# EAGLE schematic plate (EAGLE 9.5.0)
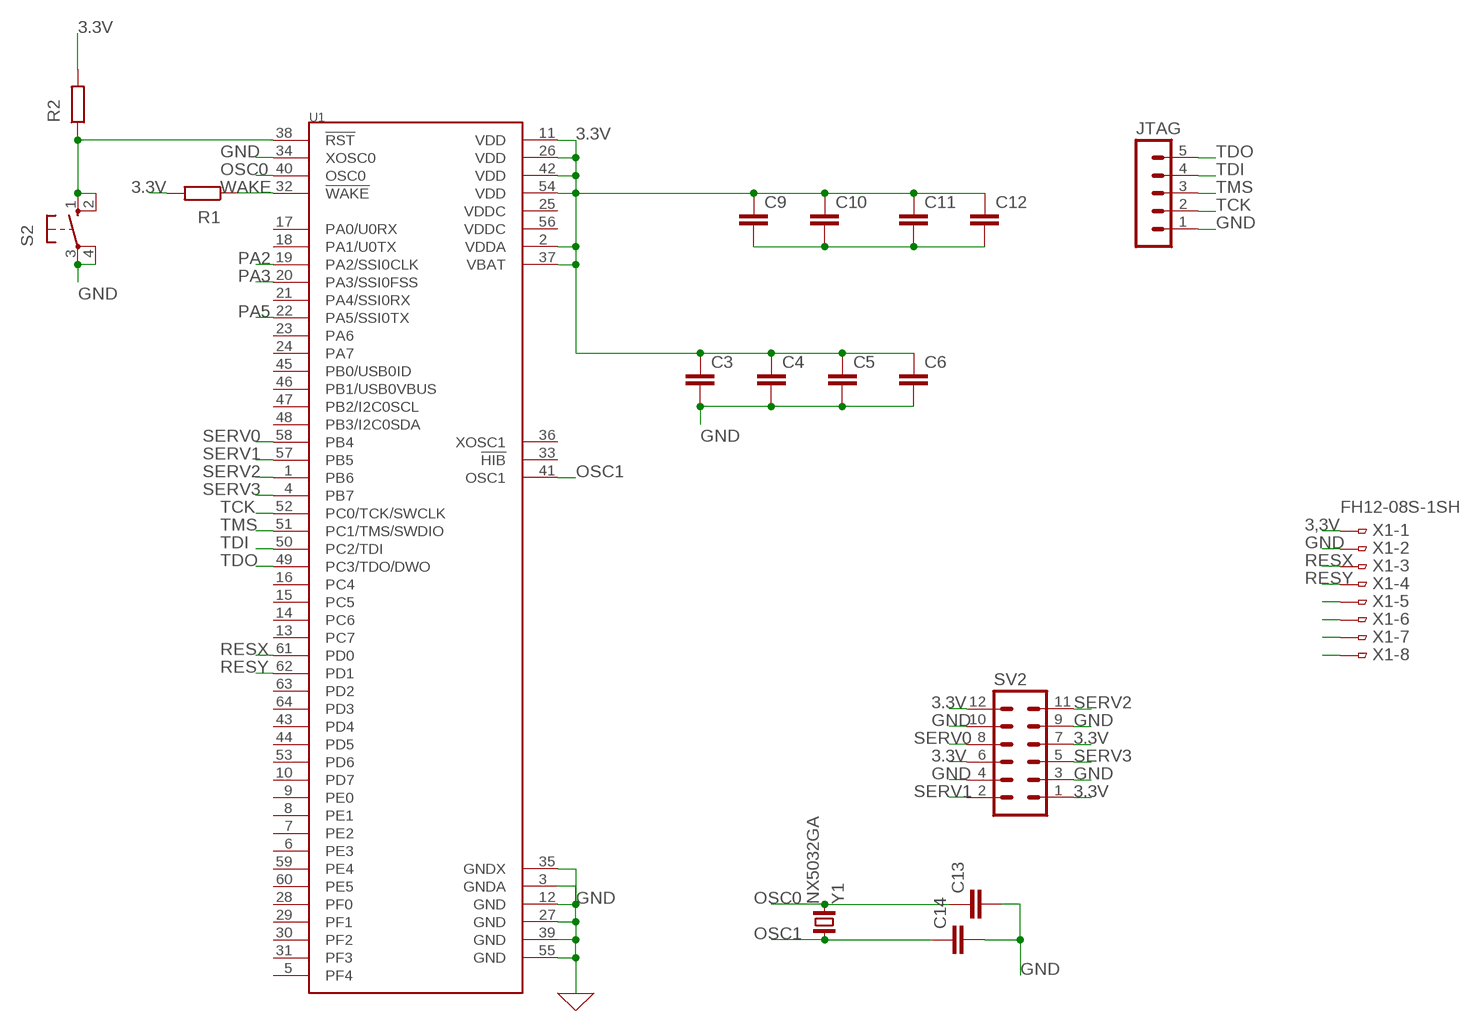
[diagram p0: schematic, sheet 1]

## Parts
C3  C2.5/2  [C2.5-2]
C4  C2.5/2  [C2.5-2]
C5  C2.5/2  [C2.5-2]
C6  C2.5/2  [C2.5-2]
C9  C2.5/2  [C2.5-2]
C10  C2.5/2  [C2.5-2]
C11  C2.5/2  [C2.5-2]
C12  C2.5/2  [C2.5-2]
C13  C2.5/2  [C2.5-2]
C14  C2.5/2  [C2.5-2]
JTAG  MA05-1  [MA05-1]
R1  R  (no package)
R2  R  (no package)
S2  10-XX  [B3F-10XX]
SV2  MA06-2  [MA06-2]
U1  TM4C123GH6PMI  [QFP50P1200X1200X160-64N]
X1  FH12-08S-1SH  [FH12-08S-1SH]
Y1  NX5032GA  [2-SMD-5X3]

## Nets
3,3V: X1.1
3.3V: C3.1 C4.1 C5.1 C6.1 C9.1 C10.1 C11.1 C12.1 R1.2 R2.2 SV2.1 SV2.6 SV2.7 SV2.12 U1.2(VDDA) U1.11(VDD) U1.26(VDD) U1.37(VBAT) U1.42(VDD) U1.54(VDD)
GND: C3.2 C4.2 C5.2 C6.2 C13.2 C14.2 JTAG.1 S2.3(P) S2.4(P1) SV2.3 SV2.4 SV2.9 SV2.10 U1.3(GNDA) U1.12(GND) U1.27(GND) U1.34(XOSC0) U1.35(GNDX) U1.39(GND) U1.55(GND) X1.2
N$1: C9.2 C10.2 C11.2 C12.2
N$6: R2.1 S2.1(S) S2.2(S1) U1.38(!RST)
N$13: X1.5
N$14: X1.6
N$15: X1.7
N$16: X1.8
OSC0: C13.1 U1.40(OSC0) Y1.2
OSC1: C14.1 U1.41(OSC1) Y1.1
PA2: U1.19(PA2/SSI0CLK)
PA3: U1.20(PA3/SSI0FSS)
PA5: U1.22(PA5/SSI0TX)
RESX: U1.61(PD0) X1.3
RESY: U1.62(PD1) X1.4
SERV0: SV2.8 U1.58(PB4)
SERV1: SV2.2 U1.57(PB5)
SERV2: SV2.11 U1.1(PB6)
SERV3: SV2.5 U1.4(PB7)
TCK: JTAG.2 U1.52(PC0/TCK/SWCLK)
TDI: JTAG.4 U1.50(PC2/TDI)
TDO: JTAG.5 U1.49(PC3/TDO/DWO)
TMS: JTAG.3 U1.51(PC1/TMS/SWDIO)
WAKE: R1.1 U1.32(!WAKE)
Unconnected: U1.5(PF4) U1.6(PE3) U1.7(PE2) U1.8(PE1) U1.9(PE0) U1.10(PD7) U1.13(PC7) U1.14(PC6) U1.15(PC5) U1.16(PC4) U1.17(PA0/U0RX) U1.18(PA1/U0TX) U1.21(PA4/SSI0RX) U1.23(PA6) U1.24(PA7) U1.28(PF0) U1.29(PF1) U1.30(PF2) U1.31(PF3) U1.33(!HIB) U1.36(XOSC1) U1.43(PD4) U1.44(PD5) U1.45(PB0/USB0ID) U1.46(PB1/USB0VBUS) U1.47(PB2/I2C0SCL) U1.48(PB3/I2C0SDA) U1.53(PD6) U1.59(PE4) U1.60(PE5) U1.63(PD2) U1.64(PD3)

## Power pins joined to a net without a drawn wire
VDDC: U1.25(VDDC) U1.56(VDDC)

## Library data of the parts
C3-C6 C9-C14 = capacitor-wima:C: CAPACITOR naming: grid - package width
JTAG = con-lstb:MA05-1: PIN HEADER; OC_FARNELL: unknown; OC_NEWARK: unknown
R1 R2 = ngspice-simulation:R: RESISTOR
S2 = switch-omron:10-XX: OMRON SWITCH; MPN: B3F-1000; OC_FARNELL: 176432; OC_NEWARK: 36M3542
SV2 = con-lstb:MA06-2: PIN HEADER; OC_FARNELL: unknown; OC_NEWARK: unknown
U1 = TM4C123GH6PMI:TM4C123GH6PMI: MCU 32-Bit Tiva C ARM Cortex M4F RISC 256KB Flash 1.2V/3.3V 64-Pin LQFP Tray/Tube; AVAILABILITY: Unavailable; DESCRIPTION: MCU 32-Bit Tiva C ARM Cortex M4F RISC 256KB Flash 1.2V/3.3V 64-Pin LQFP Tray/Tube; MF: Texas Instruments; MP: TM4C123GH6PMI; PACKAGE: LQFP-64 Texas Instruments; PRICE: None
X1 = con-hirose:FH12-08S-1S: 1mm Pitch Connectors For FPC/FFC Source: Data sheet <http://www.hirose.co.jp/cataloge_hp/e58605370.pdf>; OC_FARNELL: unknown; OC_NEWARK: unknown
Y1 = NX5032GA:NX5032GA: CRYSTAL; AVAILABILITY: Unavailable; DESCRIPTION: 20MHz, 50ppm, NX5032GA, QUARTZ CRYSTAL/20MH; MF: NDK America,; MP: NX5032GA; PACKAGE: SMD-2 NDK America,; PRICE: None